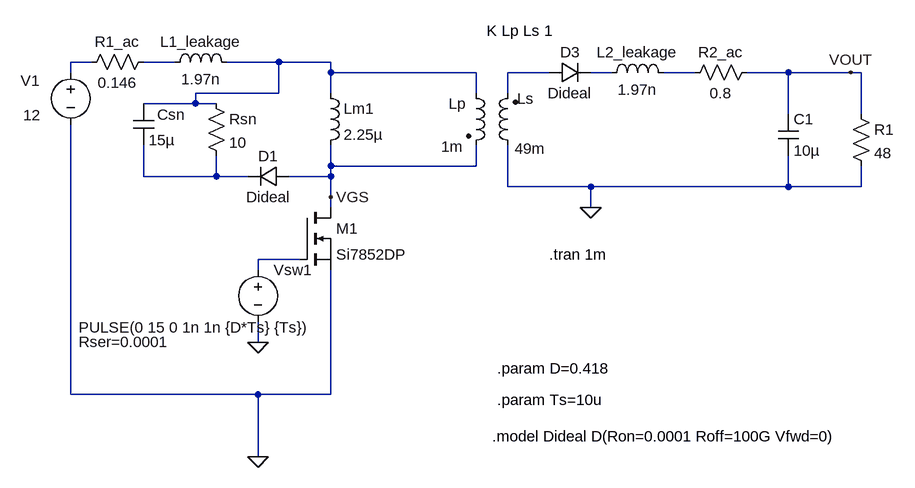
[diagram p0: schematic hw_non_ideal.asc]
hw_non_ideal.asc, the LTspice schematic file:
Version 4
SHEET 1 880 680
WIRE -432 -144 -464 -144
WIRE -304 -144 -352 -144
WIRE -144 -144 -224 -144
WIRE -64 -144 -144 -144
WIRE -464 -128 -464 -144
WIRE -64 -128 -64 -144
WIRE 160 -128 -64 -128
WIRE 272 -128 208 -128
WIRE 368 -128 336 -128
WIRE 496 -128 448 -128
WIRE 640 -128 576 -128
WIRE 736 -128 640 -128
WIRE 752 -128 736 -128
WIRE -144 -96 -144 -144
WIRE -144 -96 -272 -96
WIRE -64 -96 -64 -128
WIRE 160 -96 160 -128
WIRE 208 -96 208 -128
WIRE -272 -80 -272 -96
WIRE -272 -80 -352 -80
WIRE -240 -80 -272 -80
WIRE 640 -64 640 -128
WIRE 752 -64 752 -128
WIRE -64 16 -64 -16
WIRE 160 16 160 -16
WIRE 160 16 -64 16
WIRE -352 32 -352 -16
WIRE -240 32 -240 0
WIRE -240 32 -352 32
WIRE -192 32 -240 32
WIRE -64 32 -64 16
WIRE -64 32 -128 32
WIRE 208 48 208 -16
WIRE 336 48 208 48
WIRE 640 48 640 0
WIRE 640 48 336 48
WIRE 752 48 752 16
WIRE 752 48 640 48
WIRE -64 64 -64 32
WIRE -64 80 -64 64
WIRE 336 80 336 48
WIRE -112 160 -176 160
WIRE -176 176 -176 160
WIRE -176 288 -176 256
WIRE -464 368 -464 -48
WIRE -176 368 -464 368
WIRE -64 368 -64 176
WIRE -64 368 -176 368
WIRE -176 464 -176 368
FLAG 336 80 0
FLAG -176 288 0
FLAG -176 464 0
FLAG 736 -128 VOUT
FLAG -64 64 VGS
SYMBOL voltage -464 -144 R0
WINDOW 3 -73 82 Left 2
WINDOW 0 -77 29 Left 2
SYMATTR Value 12
SYMATTR InstName V1
SYMATTR SpiceLine Rser=0.0001
SYMBOL ind2 144 -112 R0
WINDOW 0 -27 32 Left 2
WINDOW 3 -38 98 Left 2
SYMATTR InstName Lp
SYMATTR Value 1m
SYMATTR Type ind
SYMBOL ind2 224 0 R180
WINDOW 0 -24 88 Left 2
WINDOW 3 -42 11 Left 2
SYMATTR InstName Ls
SYMATTR Value 49m
SYMATTR Type ind
SYMBOL res 736 -80 R0
SYMATTR InstName R1
SYMATTR Value 48
SYMBOL ind -80 -112 R0
SYMATTR InstName Lm1
SYMATTR Value 2.25µ
SYMBOL voltage -176 160 R0
WINDOW 3 -276 105 Left 2
WINDOW 39 -276 127 Left 2
SYMATTR Value PULSE(0 15 0 1n 1n {D*Ts} {Ts})
SYMATTR SpiceLine Rser=0.0001
SYMATTR InstName Vsw1
SYMBOL nmos -112 80 R0
SYMATTR InstName M1
SYMATTR Value Si7852DP
SYMBOL cap 624 -64 R0
SYMATTR InstName C1
SYMATTR Value 10µ
SYMBOL ind -320 -128 R270
WINDOW 0 32 56 VTop 2
WINDOW 3 5 56 VBottom 2
SYMATTR InstName L1_leakage
SYMATTR Value 1.97n
SYMBOL res -336 -160 R90
WINDOW 0 0 56 VBottom 2
WINDOW 3 32 56 VTop 2
SYMATTR InstName R1_ac
SYMATTR Value 0.146
SYMBOL ind 352 -112 R270
WINDOW 0 32 56 VTop 2
WINDOW 3 5 56 VBottom 2
SYMATTR InstName L2_leakage
SYMATTR Value 1.97n
SYMBOL res 592 -144 R90
WINDOW 0 0 56 VBottom 2
WINDOW 3 32 56 VTop 2
SYMATTR InstName R2_ac
SYMATTR Value 0.8
SYMBOL res -256 -96 R0
SYMATTR InstName Rsn
SYMATTR Value 10
SYMBOL cap -368 -80 R0
WINDOW 0 37 17 Left 2
SYMATTR InstName Csn
SYMATTR Value 15µ
SYMBOL diode 272 -112 R270
WINDOW 0 32 32 VTop 2
WINDOW 3 0 32 VBottom 2
SYMATTR InstName D3
SYMATTR Value Dideal
SYMBOL diode -128 16 R90
WINDOW 0 0 32 VBottom 2
WINDOW 3 32 32 VTop 2
SYMATTR InstName D1
SYMATTR Value Dideal
TEXT 272 152 Left 2 !.tran 1m
TEXT 176 -192 Left 2 !K Lp Ls 1
TEXT 192 328 Left 2 !.param D=0.418
TEXT 192 376 Left 2 !.param Ts=10u
TEXT 184 432 Left 2 !.model Dideal D(Ron=0.0001 Roff=100G Vfwd=0)

The netlist it stands for:
* hw_non_ideal.asc
V1 N001 0 12 Rser=0.0001
Lp N003 VGS 1m
Ls 0 N004 49m
R1 VOUT 0 48
Lm1 N003 VGS 2.25µ
Vsw1 N008 0 PULSE(0 15 0 1n 1n {D*Ts} {Ts}) Rser=0.0001
M1 VGS N008 0 0 Si7852DP
C1 VOUT 0 10µ
L1_leakage N002 N003 1.97n
R1_ac N002 N001 0.146
L2_leakage N005 N006 1.97n
R2_ac VOUT N006 0.8
Rsn N003 N007 10
Csn N003 N007 15µ
D3 N004 N005 Dideal
D1 VGS N007 Dideal
.model D D
.lib standard.dio
.model NMOS NMOS
.model PMOS PMOS
.lib standard.mos
.tran 1m
K Lp Ls 1
.param D=0.418
.param Ts=10u
.model Dideal D(Ron=0.0001 Roff=100G Vfwd=0)
.backanno
.end